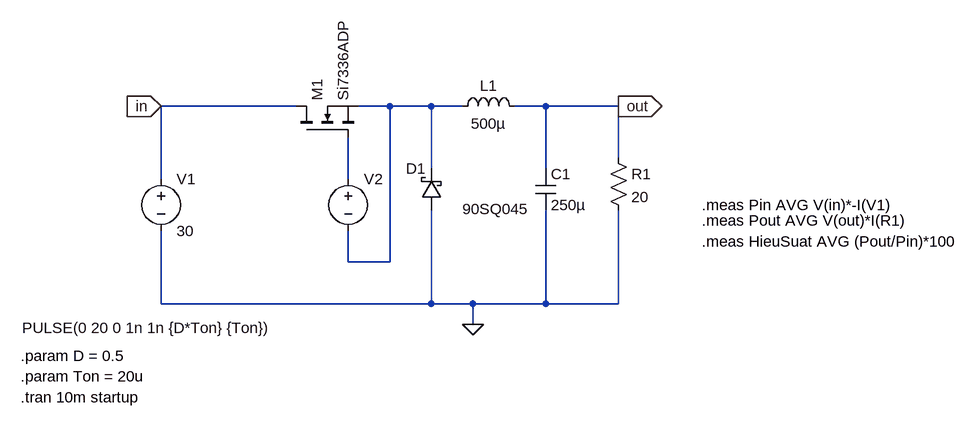
[diagram p0: schematic Bai 3.asc]
Bai 3.asc, the LTspice schematic file:
Version 4
SHEET 1 1356 680
WIRE 176 32 -32 32
WIRE 320 32 272 32
WIRE 384 32 320 32
WIRE 432 32 384 32
WIRE 560 32 512 32
WIRE 672 32 560 32
WIRE 672 112 672 32
WIRE 384 128 384 32
WIRE 560 128 560 32
WIRE -32 144 -32 32
WIRE 256 144 256 80
WIRE 256 272 256 224
WIRE 320 272 320 32
WIRE 320 272 256 272
WIRE -32 336 -32 224
WIRE 384 336 384 192
WIRE 384 336 -32 336
WIRE 448 336 384 336
WIRE 560 336 560 192
WIRE 560 336 448 336
WIRE 672 336 672 192
WIRE 672 336 560 336
WIRE 448 368 448 336
FLAG -32 32 in
IOPIN -32 32 In
FLAG 448 368 0
FLAG 672 32 out
IOPIN 672 32 Out
SYMBOL voltage -32 128 R0
WINDOW 123 0 0 Left 0
WINDOW 39 0 0 Left 0
SYMATTR InstName V1
SYMATTR Value 30
SYMBOL nmos 176 80 R270
SYMATTR InstName M1
SYMATTR Value Si7336ADP
SYMBOL voltage 256 128 R0
WINDOW 3 -502 245 Left 2
WINDOW 123 0 0 Left 0
WINDOW 39 0 0 Left 0
SYMATTR Value PULSE(0 20 0 1n 1n {D*Ton} {Ton})
SYMATTR InstName V2
SYMBOL ind 416 48 R270
WINDOW 0 32 56 VTop 2
WINDOW 3 5 56 VBottom 2
SYMATTR InstName L1
SYMATTR Value 500µ
SYMATTR SpiceLine Ipk=1.8 Rser=0.65 Rpar=83116.9 Cpar=0
SYMBOL schottky 400 192 R180
WINDOW 0 24 64 Left 2
WINDOW 3 -134 2 Left 2
SYMATTR InstName D1
SYMATTR Value 90SQ045
SYMATTR Description Diode
SYMATTR Type diode
SYMBOL cap 544 128 R0
SYMATTR InstName C1
SYMATTR Value 250µ
SYMATTR SpiceLine V=25 Irms=2.51 Rser=0.0329792 Lser=0
SYMBOL res 656 96 R0
SYMATTR InstName R1
SYMATTR Value 20
TEXT -248 416 Left 2 !.param D = 0.5
TEXT -248 448 Left 2 !.param Ton = 20u
TEXT -248 480 Left 2 !.tran 10m startup
TEXT 800 184 Left 2 !.meas Pin AVG V(in)*-I(V1)
TEXT 800 208 Left 2 !.meas Pout AVG V(out)*I(R1)
TEXT 800 240 Left 2 !.meas HieuSuat AVG (Pout/Pin)*100

The netlist it stands for:
* Bai 3.asc
V1 in 0 30
M1 in N002 N001 N001 Si7336ADP
V2 N002 N001 PULSE(0 20 0 1n 1n {D*Ton} {Ton})
L1 N001 out 500µ Ipk=1.8 Rser=0.65 Rpar=83116.9 Cpar=0
D1 0 N001 90SQ045
C1 out 0 250µ V=25 Irms=2.51 Rser=0.0329792 Lser=0
R1 out 0 20
.model D D
.lib standard.dio
.model NMOS NMOS
.model PMOS PMOS
.lib standard.mos
.param D = 0.5
.param Ton = 20u
.tran 10m startup
.meas Pin AVG V(in)*-I(V1)
.meas Pout AVG V(out)*I(R1)
.meas HieuSuat AVG (Pout/Pin)*100
.backanno
.end